# EAGLE schematic Button Board RevA (EAGLE 6.2)
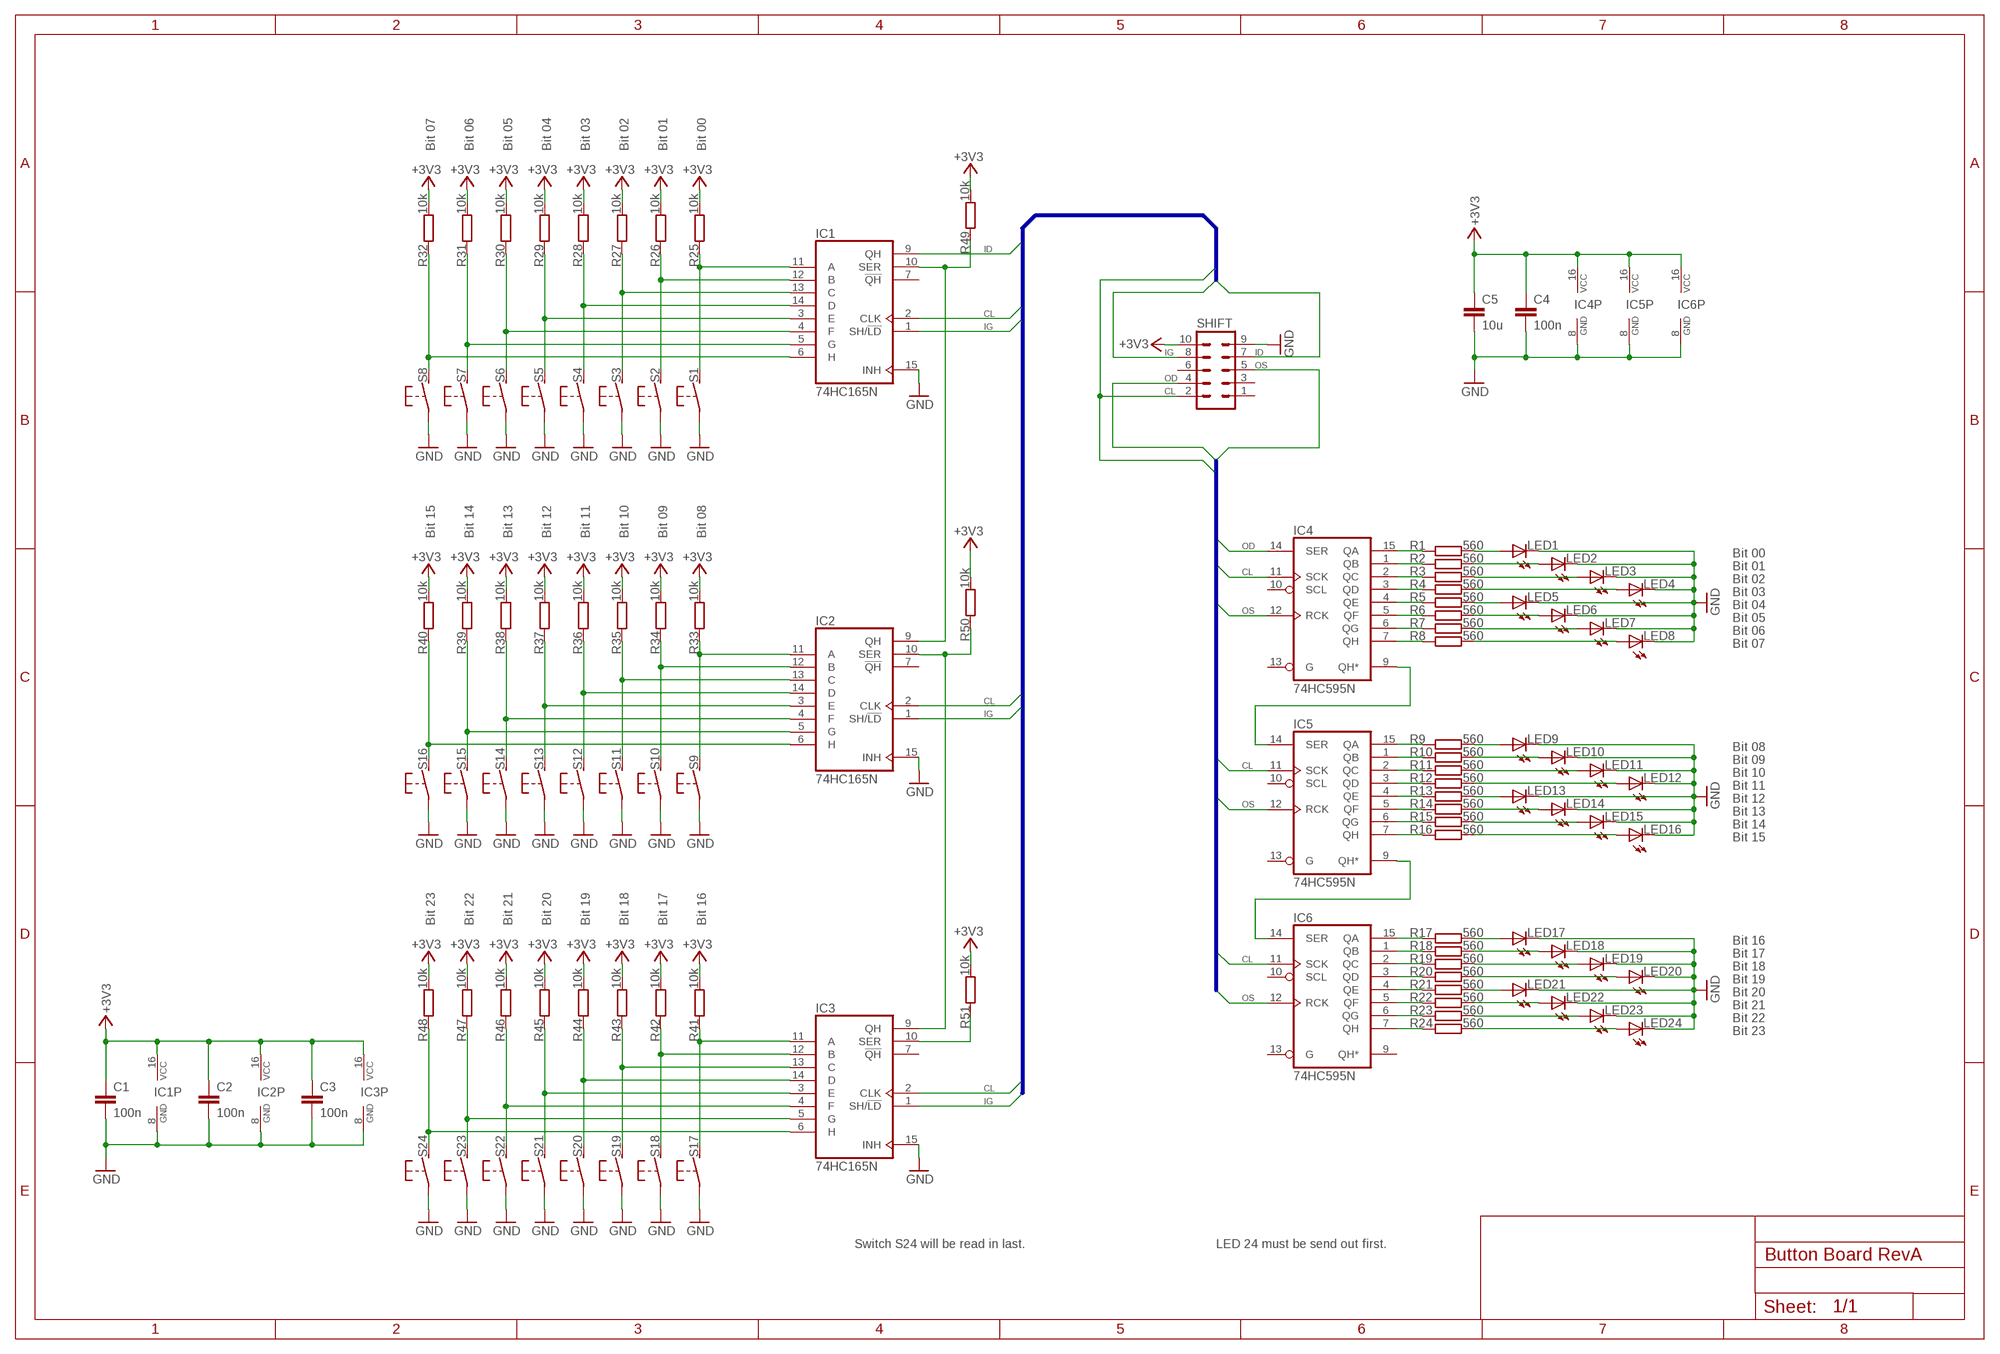
[diagram p0: schematic, sheet 1]

## Parts
C1  100n  C-EU025-025X050  [C025-025X050]
C2  100n  C-EU025-025X050  [C025-025X050]
C3  100n  C-EU025-025X050  [C025-025X050]
C4  100n  C-EU025-025X050  [C025-025X050]
C5  10u  C-EU025-025X050  [C025-025X050]
IC1  74HC165N  [DIL16]
IC2  74HC165N  [DIL16]
IC3  74HC165N  [DIL16]
IC4  74HC595N  [DIL16]
IC5  74HC595N  [DIL16]
IC6  74HC595N  [DIL16]
LED1  LED3MM  [LED3MM]
LED2  LED3MM  [LED3MM]
LED3  LED3MM  [LED3MM]
LED4  LED3MM  [LED3MM]
LED5  LED3MM  [LED3MM]
LED6  LED3MM  [LED3MM]
LED7  LED3MM  [LED3MM]
LED8  LED3MM  [LED3MM]
LED9  LED3MM  [LED3MM]
LED10  LED3MM  [LED3MM]
LED11  LED3MM  [LED3MM]
LED12  LED3MM  [LED3MM]
LED13  LED3MM  [LED3MM]
LED14  LED3MM  [LED3MM]
LED15  LED3MM  [LED3MM]
LED16  LED3MM  [LED3MM]
LED17  LED3MM  [LED3MM]
LED18  LED3MM  [LED3MM]
LED19  LED3MM  [LED3MM]
LED20  LED3MM  [LED3MM]
LED21  LED3MM  [LED3MM]
LED22  LED3MM  [LED3MM]
LED23  LED3MM  [LED3MM]
LED24  LED3MM  [LED3MM]
R1  560  R-EU_0204/5  [0204/5]
R2  560  R-EU_0204/5  [0204/5]
R3  560  R-EU_0204/5  [0204/5]
R4  560  R-EU_0204/5  [0204/5]
R5  560  R-EU_0204/5  [0204/5]
R6  560  R-EU_0204/5  [0204/5]
R7  560  R-EU_0204/5  [0204/5]
R8  560  R-EU_0204/5  [0204/5]
R9  560  R-EU_0204/5  [0204/5]
R10  560  R-EU_0204/5  [0204/5]
R11  560  R-EU_0204/5  [0204/5]
R12  560  R-EU_0204/5  [0204/5]
R13  560  R-EU_0204/5  [0204/5]
R14  560  R-EU_0204/5  [0204/5]
R15  560  R-EU_0204/5  [0204/5]
R16  560  R-EU_0204/5  [0204/5]
R17  560  R-EU_0204/5  [0204/5]
R18  560  R-EU_0204/5  [0204/5]
R19  560  R-EU_0204/5  [0204/5]
R20  560  R-EU_0204/5  [0204/5]
R21  560  R-EU_0204/5  [0204/5]
R22  560  R-EU_0204/5  [0204/5]
R23  560  R-EU_0204/5  [0204/5]
R24  560  R-EU_0204/5  [0204/5]
R25  10k  R-EU_0204/5  [0204/5]
R26  10k  R-EU_0204/5  [0204/5]
R27  10k  R-EU_0204/5  [0204/5]
R28  10k  R-EU_0204/5  [0204/5]
R29  10k  R-EU_0204/5  [0204/5]
R30  10k  R-EU_0204/5  [0204/5]
R31  10k  R-EU_0204/5  [0204/5]
R32  10k  R-EU_0204/5  [0204/5]
R33  10k  R-EU_0204/5  [0204/5]
R34  10k  R-EU_0204/5  [0204/5]
R35  10k  R-EU_0204/5  [0204/5]
R36  10k  R-EU_0204/5  [0204/5]
R37  10k  R-EU_0204/5  [0204/5]
R38  10k  R-EU_0204/5  [0204/5]
R39  10k  R-EU_0204/5  [0204/5]
R40  10k  R-EU_0204/5  [0204/5]
R41  10k  R-EU_0204/5  [0204/5]
R42  10k  R-EU_0204/5  [0204/5]
R43  10k  R-EU_0204/5  [0204/5]
R44  10k  R-EU_0204/5  [0204/5]
R45  10k  R-EU_0204/5  [0204/5]
R46  10k  R-EU_0204/5  [0204/5]
R47  10k  R-EU_0204/5  [0204/5]
R48  10k  R-EU_0204/5  [0204/5]
R49  10k  R-EU_0204/5  [0204/5]
R50  10k  R-EU_0204/5  [0204/5]
R51  10k  R-EU_0204/5  [0204/5]
S1  31-XX  [B3F-31XX]
S2  31-XX  [B3F-31XX]
S3  31-XX  [B3F-31XX]
S4  31-XX  [B3F-31XX]
S5  31-XX  [B3F-31XX]
S6  31-XX  [B3F-31XX]
S7  31-XX  [B3F-31XX]
S8  31-XX  [B3F-31XX]
S9  31-XX  [B3F-31XX]
S10  31-XX  [B3F-31XX]
S11  31-XX  [B3F-31XX]
S12  31-XX  [B3F-31XX]
S13  31-XX  [B3F-31XX]
S14  31-XX  [B3F-31XX]
S15  31-XX  [B3F-31XX]
S16  31-XX  [B3F-31XX]
S17  31-XX  [B3F-31XX]
S18  31-XX  [B3F-31XX]
S19  31-XX  [B3F-31XX]
S20  31-XX  [B3F-31XX]
S21  31-XX  [B3F-31XX]
S22  31-XX  [B3F-31XX]
S23  31-XX  [B3F-31XX]
S24  31-XX  [B3F-31XX]
SHIFT  ML10  [ML10]

## Nets
+3V3: C1.1 C2.1 C3.1 C4.1 C5.1 IC1.16(VCC) IC2.16(VCC) IC3.16(VCC) IC4.16(VCC) IC5.16(VCC) IC6.16(VCC) R25.2 R26.2 R27.2 R28.2 R29.2 R30.2 R31.2 R32.2 R33.2 R34.2 R35.2 R36.2 R37.2 R38.2 R39.2 R40.2 R41.2 R42.2 R43.2 R44.2 R45.2 R46.2 R47.2 R48.2 R49.2 R50.2 R51.2 SHIFT.10
CL: IC1.2(CLK) IC2.2(CLK) IC3.2(CLK) IC4.11(SCK) IC5.11(SCK) IC6.11(SCK) SHIFT.2
GND: C1.2 C2.2 C3.2 C4.2 C5.2 IC1.8(GND) IC1.15(INH) IC2.8(GND) IC2.15(INH) IC3.8(GND) IC3.15(INH) IC4.8(GND) IC5.8(GND) IC6.8(GND) LED1.K(C) LED2.K(C) LED3.K(C) LED4.K(C) LED5.K(C) LED6.K(C) LED7.K(C) LED8.K(C) LED9.K(C) LED10.K(C) LED11.K(C) LED12.K(C) LED13.K(C) LED14.K(C) LED15.K(C) LED16.K(C) LED17.K(C) LED18.K(C) LED19.K(C) LED20.K(C) LED21.K(C) LED22.K(C) LED23.K(C) LED24.K(C) S1.1(P) S2.1(P) S3.1(P) S4.1(P) S5.1(P) S6.1(P) S7.1(P) S8.1(P) S9.1(P) S10.1(P) S11.1(P) S12.1(P) S13.1(P) S14.1(P) S15.1(P) S16.1(P) S17.1(P) S18.1(P) S19.1(P) S20.1(P) S21.1(P) S22.1(P) S23.1(P) S24.1(P) SHIFT.9
ID: IC1.9(QH) SHIFT.7
IG: IC1.1(SH/!LD) IC2.1(SH/!LD) IC3.1(SH/!LD) SHIFT.8
N$1: IC4.15(QA) R1.1
N$2: IC4.1(QB) R2.1
N$3: IC4.2(QC) R3.1
N$4: IC4.3(QD) R4.1
N$5: IC4.4(QE) R5.1
N$6: IC4.5(QF) R6.1
N$7: IC4.6(QG) R7.1
N$8: IC4.7(QH) R8.1
N$9: IC5.15(QA) R9.1
N$10: IC5.1(QB) R10.1
N$11: IC5.2(QC) R11.1
N$12: IC5.3(QD) R12.1
N$13: IC5.4(QE) R13.1
N$14: IC5.5(QF) R14.1
N$15: IC5.6(QG) R15.1
N$16: IC5.7(QH) R16.1
N$17: IC6.15(QA) R17.1
N$18: IC6.1(QB) R18.1
N$19: IC6.2(QC) R19.1
N$20: IC6.3(QD) R20.1
N$21: IC6.4(QE) R21.1
N$22: IC6.5(QF) R22.1
N$23: IC6.6(QG) R23.1
N$24: IC6.7(QH) R24.1
N$25: LED1.A R1.2
N$26: LED2.A R2.2
N$27: LED3.A R3.2
N$28: LED4.A R4.2
N$29: LED5.A R5.2
N$30: LED6.A R6.2
N$31: LED7.A R7.2
N$32: LED8.A R8.2
N$34: LED9.A R9.2
N$35: LED10.A R10.2
N$36: LED11.A R11.2
N$37: LED12.A R12.2
N$38: LED13.A R13.2
N$39: LED14.A R14.2
N$40: LED15.A R15.2
N$41: LED16.A R16.2
N$42: IC4.9(QH*) IC5.14(SER)
N$43: LED17.A R17.2
N$44: LED18.A R18.2
N$45: LED19.A R19.2
N$46: LED20.A R20.2
N$47: LED21.A R21.2
N$48: LED22.A R22.2
N$49: LED23.A R23.2
N$50: LED24.A R24.2
N$51: IC5.9(QH*) IC6.14(SER)
N$54: IC1.11(A) R25.1 S1.2(S)
N$55: IC1.12(B) R26.1 S2.2(S)
N$56: IC1.13(C) R27.1 S3.2(S)
N$57: IC1.14(D) R28.1 S4.2(S)
N$58: IC1.3(E) R29.1 S5.2(S)
N$59: IC1.4(F) R30.1 S6.2(S)
N$60: IC1.5(G) R31.1 S7.2(S)
N$61: IC1.6(H) R32.1 S8.2(S)
N$62: IC2.11(A) R33.1 S9.2(S)
N$63: IC2.12(B) R34.1 S10.2(S)
N$64: IC2.13(C) R35.1 S11.2(S)
N$65: IC2.14(D) R36.1 S12.2(S)
N$66: IC2.3(E) R37.1 S13.2(S)
N$67: IC2.4(F) R38.1 S14.2(S)
N$68: IC2.5(G) R39.1 S15.2(S)
N$69: IC2.6(H) R40.1 S16.2(S)
N$70: IC3.11(A) R41.1 S17.2(S)
N$71: IC3.12(B) R42.1 S18.2(S)
N$72: IC3.13(C) R43.1 S19.2(S)
N$73: IC3.14(D) R44.1 S20.2(S)
N$74: IC3.3(E) R45.1 S21.2(S)
N$75: IC3.4(F) R46.1 S22.2(S)
N$76: IC3.5(G) R47.1 S23.2(S)
N$77: IC3.6(H) R48.1 S24.2(S)
N$79: IC1.10(SER) IC2.9(QH) R49.1
N$80: IC2.10(SER) IC3.9(QH) R50.1
N$81: IC3.10(SER) R51.1
OD: IC4.14(SER) SHIFT.4
OS: IC4.12(RCK) IC5.12(RCK) IC6.12(RCK) SHIFT.5
Unconnected: IC1.7(!QH) IC2.7(!QH) IC3.7(!QH) IC4.10(SCL) IC4.13(G) IC5.10(SCL) IC5.13(G) IC6.9(QH*) IC6.10(SCL) IC6.13(G) SHIFT.1 SHIFT.3 SHIFT.6

## Buses
CL,OD,OS
CL,ID,IG

## Notes on the sheet
- Bit 07 | Bit 06 | Bit 05 | Bit 04 | Bit 03 | Bit 02 | Bit 01 | Bit 00
- Bit 15 | Bit 14 | Bit 13 | Bit 12 | Bit 11 | Bit 10 | Bit 09 | Bit 08
- Bit 00
- Bit 01
- Bit 02
- Bit 03
- Bit 04
- Bit 05
- Bit 06
- Bit 07
- Bit 08
- Bit 09
- Bit 10
- Bit 11
- Bit 12
- Bit 13
- Bit 14
- Bit 15
- Bit 23 | Bit 22 | Bit 21 | Bit 20 | Bit 19 | Bit 18 | Bit 17 | Bit 16
- Bit 16
- Bit 17
- Bit 18
- Bit 19
- Bit 20
- Bit 21
- Bit 22
- Bit 23
- Switch S24 will be read in last. | LED 24 must be send out first.

## Library data of the parts
C1-C5 = rcl:C-EU: CAPACITOR, European symbol
IC1-IC3 = 74xx-eu:74*165: 8-bit parallel load SHIFT REGISTER
IC4-IC6 = 74xx-eu:74*595: 8-bit SHIFT REGISTER, output latch
LED1-LED24 = led:LED: LED OSRAM: - CHIPLED LG R971, LG N971, LY N971, LG Q971, LY Q971, LO R971, LY R971 LH N974, LH R974 LS Q976, LO Q976, LY Q976 LO Q996 - Hyper CHIPLED LW Q18S LB Q993, LB Q99A, LB R99A - SideLED LS A670, LO A670, LY A670, LG A670, LP A670 LB A673, LV A673, LT A673, LW A673 LH A674 LY A675 LS A676, LA A676, LO A676, LY A676, LW A676 LS A679, LY A679, LG A679 - Hyper Micro SIDELED® LS Y876, LA Y876, LO Y876, LY Y876 LT Y87S - SmartLED LW L88C, LW L88S LB L89C, LB L89S, LG L890 LS L89K, LO L89K, LY L89K LS L896, LA L896, LO L896, LY L896 - TOPLED LS T670, LO T670, LY T670, LG T670, LP T670 LSG T670, LSP T670, LSY T670, LOP T670, LYG T670 LG T671, LOG T671, LSG T671 LB T673, LV T673, LT T673, LW T673 LH T674 LS T676, LA T676, LO T676, LY T676, LB T676, LH T676, LSB T676, LW T676 LB T67C, LV T67C, LT T67C, LS T67K, LO T67K, LY T67K, LW E67C LS E67B, LA E67B, LO E67B, LY E67B, LB E67C, LV E67C, LT E67C LW T67C LS T679, LY T679, LG T679 LS T770, LO T770, LY T770, LG T770, LP T770 LB T773, LV T773, LT T773, LW T773 LH T774 LS E675, LA E675, LY E675, LS T675 LS T776, LA T776, LO T776, LY T776, LB T776 LHGB T686 LT T68C, LB T68C - Hyper Mini TOPLED® LB M676 - Mini TOPLED Santana® LG M470 LS M47K, LO M47K, LY M47K Source: http://www.osram.convergy.de LUXEON: - LUMILED® LXK2-PW12-R00, LXK2-PW12-S00, LXK2-PW14-U00, LXK2-PW14-V00 LXK2-PM12-R00, LXK2-PM12-S00, LXK2-PM14-U00 LXK2-PE12-Q00, LXK2-PE12-R00, LXK2-PE12-S00, LXK2-PE14-T00, LXK2-PE14-U00 LXK2-PB12-K00, LXK2-PB12-L00, LXK2-PB12-M00, LXK2-PB14-N00, LXK2-PB14-P00, LXK2-PB14-Q00 LXK2-PR12-L00, LXK2-PR12-M00, LXK2-PR14-Q00, LXK2-PR14-R00 LXK2-PD12-Q00, LXK2-PD12-R00, LXK2-PD12-S00 LXK2-PH12-R00, LXK2-PH12-S00 LXK2-PL12-P00, LXK2-PL12-Q00, LXK2-PL12-R00 Source: www.luxeon.com KINGBRIGHT: KA-3528ASYC Source: www.kingbright.com
R1-R51 = rcl:R-EU_: RESISTOR, European symbol
S1-S24 = switch-omron:31-XX: OMRON SWITCH; MPN: B3F-3100; OC_FARNELL: 959704; OC_NEWARK: 36M3582
SHIFT = con-harting-ml:ML10: HARTING; OC_FARNELL: unknown; OC_NEWARK: unknown